# EAGLE design test-cell-one-shot (EAGLE 6.1)
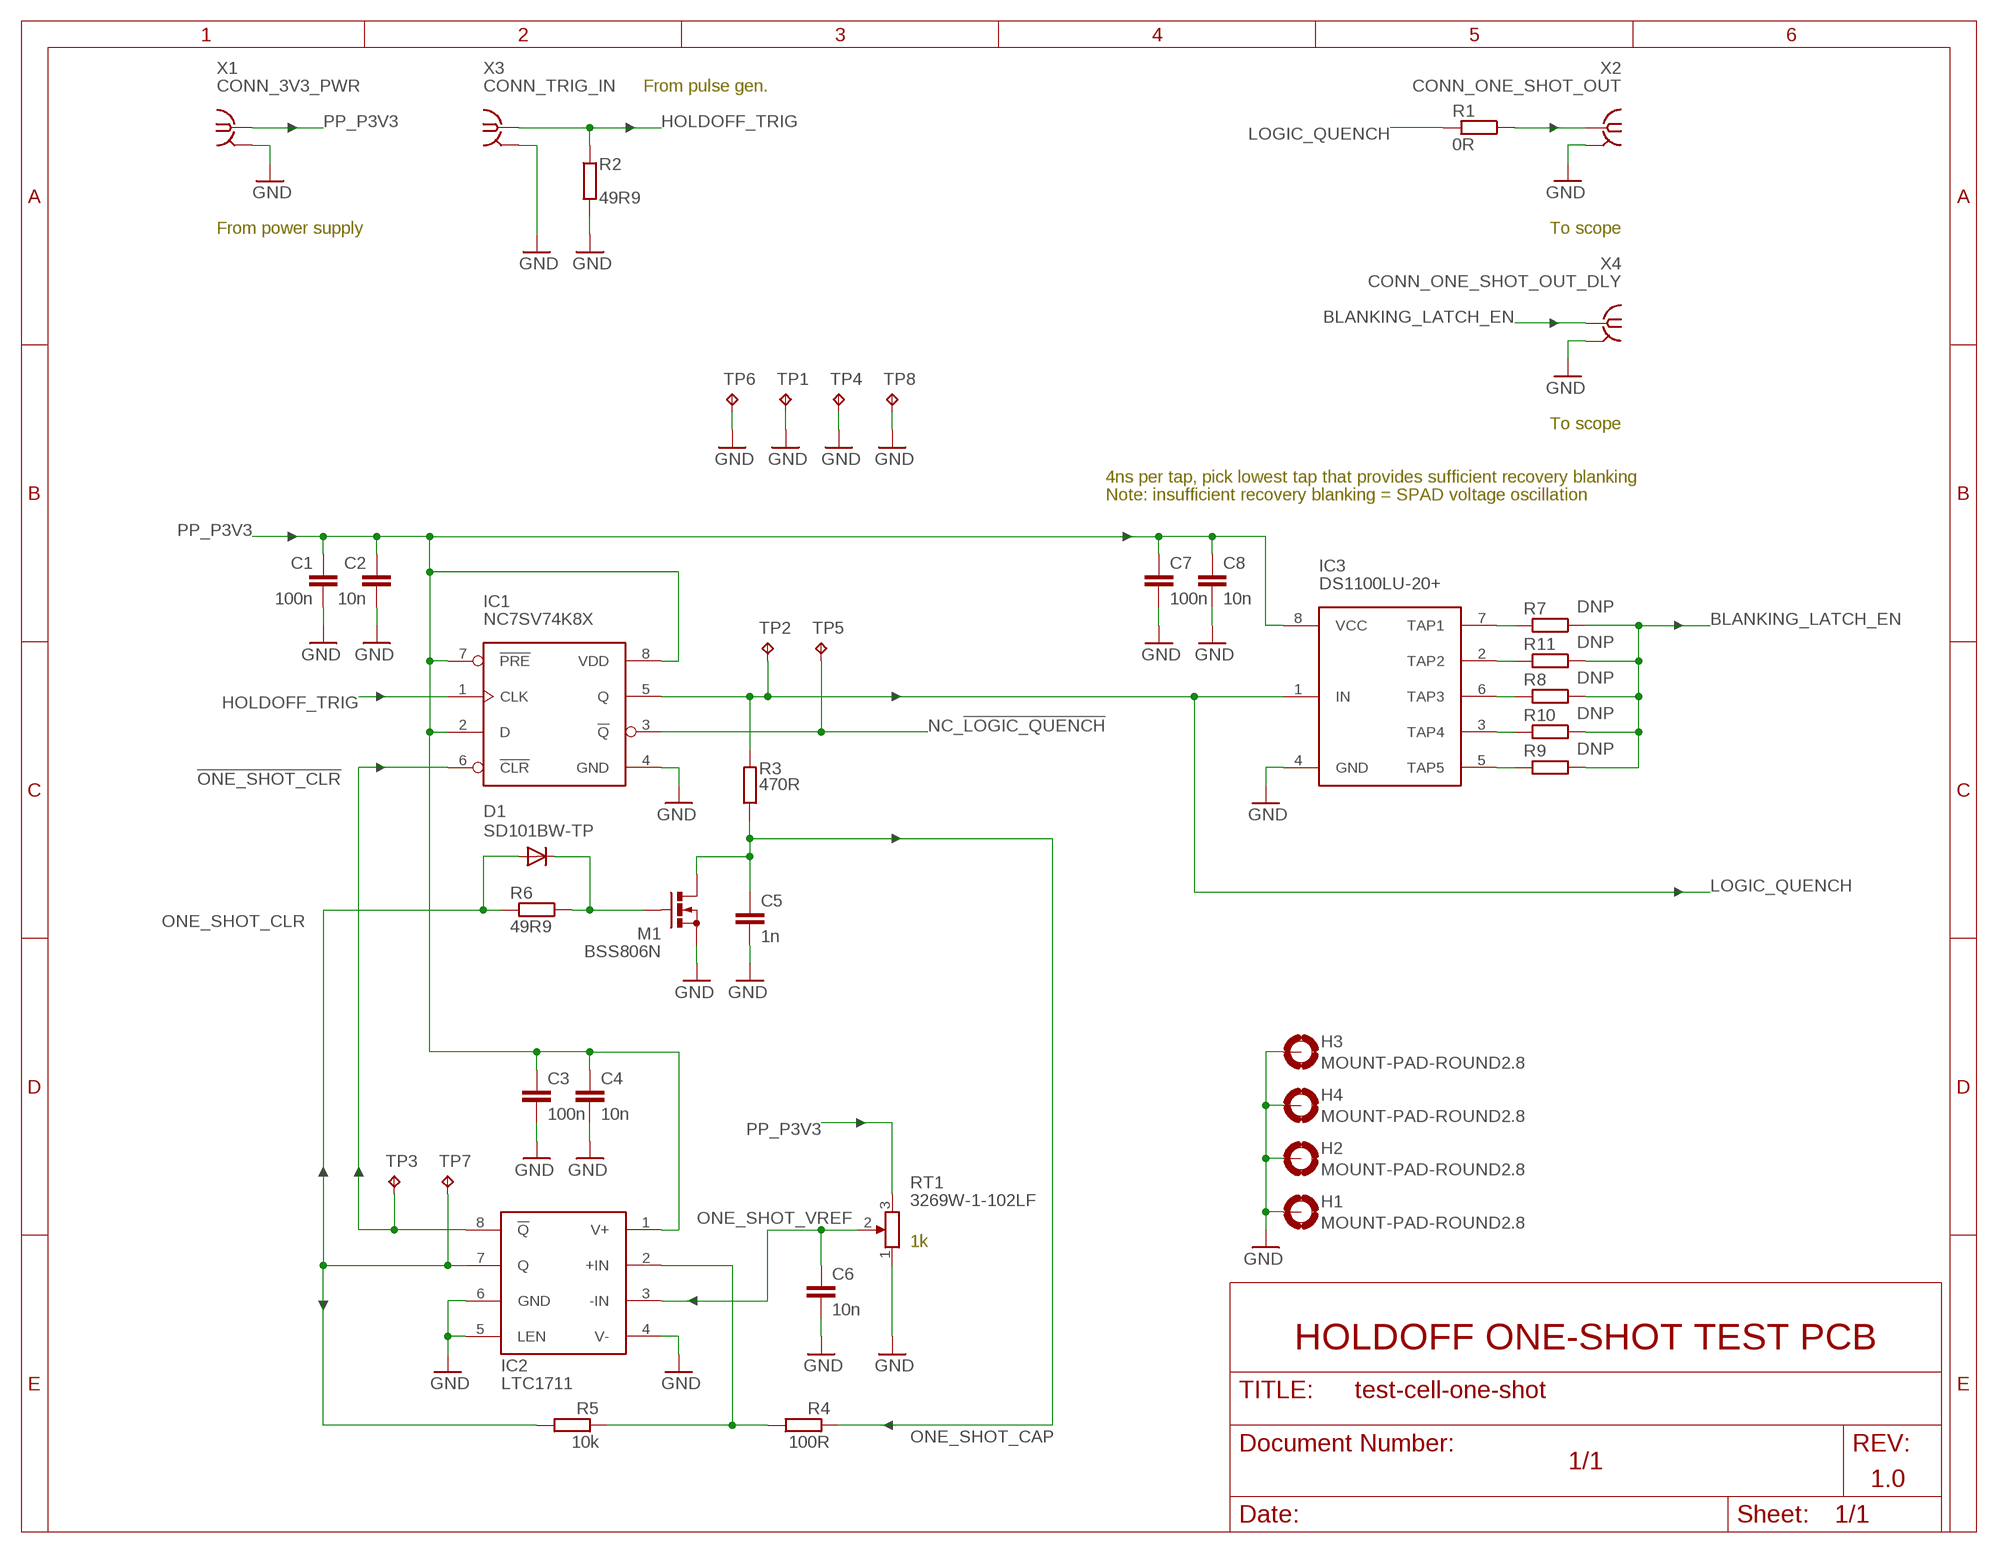
[diagram p0: schematic, sheet 1]

## Parts
C1  100n  C-EUC0402  [C0402]
C2  10n  C-EUC0402  [C0402]
C3  100n  C-EUC0402  [C0402]
C4  10n  C-EUC0402  [C0402]
C5  1n  C-EUC0402  [C0402]
C6  10n  C-EUC0402  [C0402]
C7  100n  C-EUC0402  [C0402]
C8  10n  C-EUC0402  [C0402]
D1  SD101BW-TP  DIODE-SOD123  [SOD123]
H1  MOUNT-PAD-ROUND2.8  [2,8-PAD]
H2  MOUNT-PAD-ROUND2.8  [2,8-PAD]
H3  MOUNT-PAD-ROUND2.8  [2,8-PAD]
H4  MOUNT-PAD-ROUND2.8  [2,8-PAD]
IC1  NC7SV74K8X  [US8_3.1MM_JDEC_MO-187]
IC2  LTC1711  [US8_3.1MM_JDEC_MO-187]
IC3  DS1100LU-20+  DS1100L  [US8_3.1MM_JDEC_MO-187]
M1  BSS806N  [SOT23R_INFINEON]
R1  0R  R-EU_R0402  [R0402]
R2  49R9  R-EU_R0603  [R0603]
R3  470R  R-EU_R0402  [R0402]
R4  100R  R-EU_R0402  [R0402]
R5  10k  R-EU_R0402  [R0402]
R6  49R9  R-EU_R0402  [R0402]
R7  DNP  R-EU_R0402  [R0402]
R8  DNP  R-EU_R0402  [R0402]
R9  DNP  R-EU_R0402  [R0402]
R10  DNP  R-EU_R0402  [R0402]
R11  DNP  R-EU_R0402  [R0402]
RT1  3269W-1-102LF  BOURNS_3269WX  [3269W]
TP1  TPTP10R  [TP10R]
TP2  TPTP10R  [TP10R]
TP3  TPTP10R  [TP10R]
TP4  TPTP10R  [TP10R]
TP5  TPTP10R  [TP10R]
TP6  TPTP10R  [TP10R]
TP7  TPTP10R  [TP10R]
TP8  TPTP10R  [TP10R]
X1  CONN_3V3_PWR  SMA-142-0711-871/876  [J502-ND-142-0711-871/876]
X2  CONN_ONE_SHOT_OUT  SMA-142-0711-871/876  [J502-ND-142-0711-871/876]
X3  CONN_TRIG_IN  SMA-142-0711-871/876  [J502-ND-142-0711-871/876]
X4  CONN_ONE_SHOT_OUT_DLY  SMA-142-0711-871/876  [J502-ND-142-0711-871/876]

## Nets
!ONE_SHOT_CLR: IC1.6(!CLR) IC2.8(!Q) TP3.TP
BLANKING_LATCH_EN: R7.1 R8.1 R9.1 R10.1 R11.1 X4.1
GND: C1.2 C2.2 C3.2 C4.2 C5.2 C6.2 C7.2 C8.2 H1.B2,8(MOUNT) H2.B2,8(MOUNT) H3.B2,8(MOUNT) H4.B2,8(MOUNT) IC1.4(GND) IC2.4(V-) IC2.5(LEN) IC2.6(GND) IC3.4(GND) M1.2(S) R2.2 RT1.1 TP1.TP TP4.TP TP6.TP TP8.TP X1.G@1(GND) X2.G@1(GND) X3.G@1(GND) X4.G@1(GND)
HOLDOFF_TRIG: IC1.1(CLK) R2.1 X3.1
LOGIC_QUENCH: IC1.5(Q) IC3.1(IN) R1.2 R3.2 TP2.TP
N$1: IC3.5(TAP5) R9.2
N$2: D1.C M1.1(G) R6.1
N$3: R1.1 X2.1
N$7: IC3.3(TAP4) R10.2
N$17: IC3.6(TAP3) R8.2
N$25: IC2.2(+IN) R4.1 R5.2
N$28: IC3.2(TAP2) R11.2
N$32: IC3.7(TAP1) R7.2
NC_!LOGIC_QUENCH: IC1.3(!Q) TP5.TP
ONE_SHOT_CAP: C5.1 M1.3(D) R3.1 R4.2
ONE_SHOT_CLR: D1.A IC2.7(Q) R5.1 R6.2 TP7.TP
ONE_SHOT_VREF: C6.1 IC2.3(-IN) RT1.2
PP_P3V3: C1.1 C2.1 C3.1 C4.1 C7.1 C8.1 IC1.2(D) IC1.7(!PRE) IC1.8(VDD) IC2.1(V+) IC3.8(VCC) RT1.3 X1.1

## Notes on the sheet
- From pulse gen.
- From power supply | To scope
- To scope
- 4ns per tap, pick lowest tap that provides sufficient recovery blanking
- Note: insufficient recovery blanking = SPAD voltage oscillation
- 1k
- HOLDOFF ONE-SHOT TEST PCB
- 1/1
- 1.0

## Power pins joined to a net without a drawn wire
GND: X1.G@2(GND) X1.G@3(GND) X1.G@4(GND) X2.G@2(GND) X2.G@3(GND) X2.G@4(GND) X3.G@2(GND) X3.G@3(GND) X3.G@4(GND) X4.G@2(GND) X4.G@3(GND) X4.G@4(GND)

## Library data of the parts
C1-C8 = rcl:C-EU: CAPACITOR, European symbol
D1 = diode:DIODE-: DIODE
H1-H4 = holes:MOUNT-PAD-ROUND: MOUNTING PAD, round
IC1 = meng:NC7SV74K8X
IC2 = meng:LTC1711
IC3 = meng:DS1100L; VALUE: DS1100L
M1 = meng:BSS806N
R1-R11 = rcl:R-EU_: RESISTOR, European symbol
RT1 = meng:BOURNS_3269WX
TP1-TP8 = testpad:TP: Test pad
X1-X4 = con-coax:SMA-: SMA 50 Ohm End Launch Jack Receptacle - Round Contact Johnson Components Source: www.johnsoncomponents.com .. J502-ND.pdf; MF: JOHNSON COMPONENTS; MPN: 142-0711-871; OC_FARNELL: unknown; OC_NEWARK: 01C1639

## Board
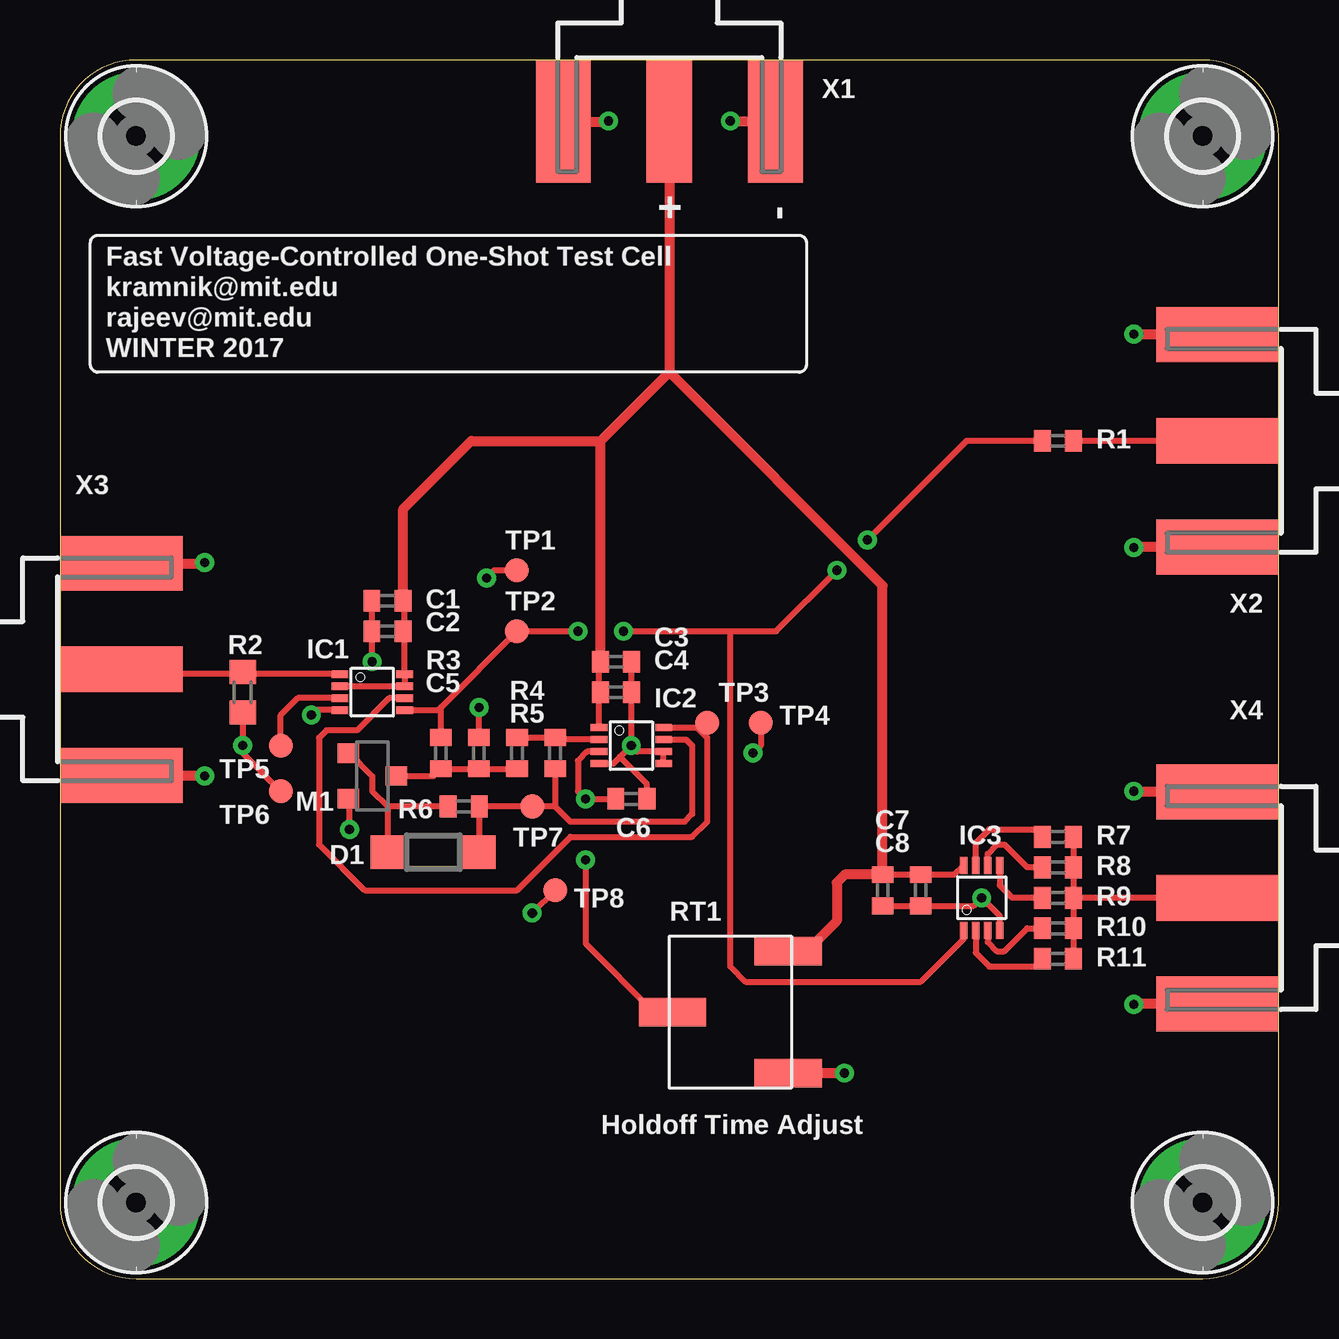
[diagram p1: board, top side]
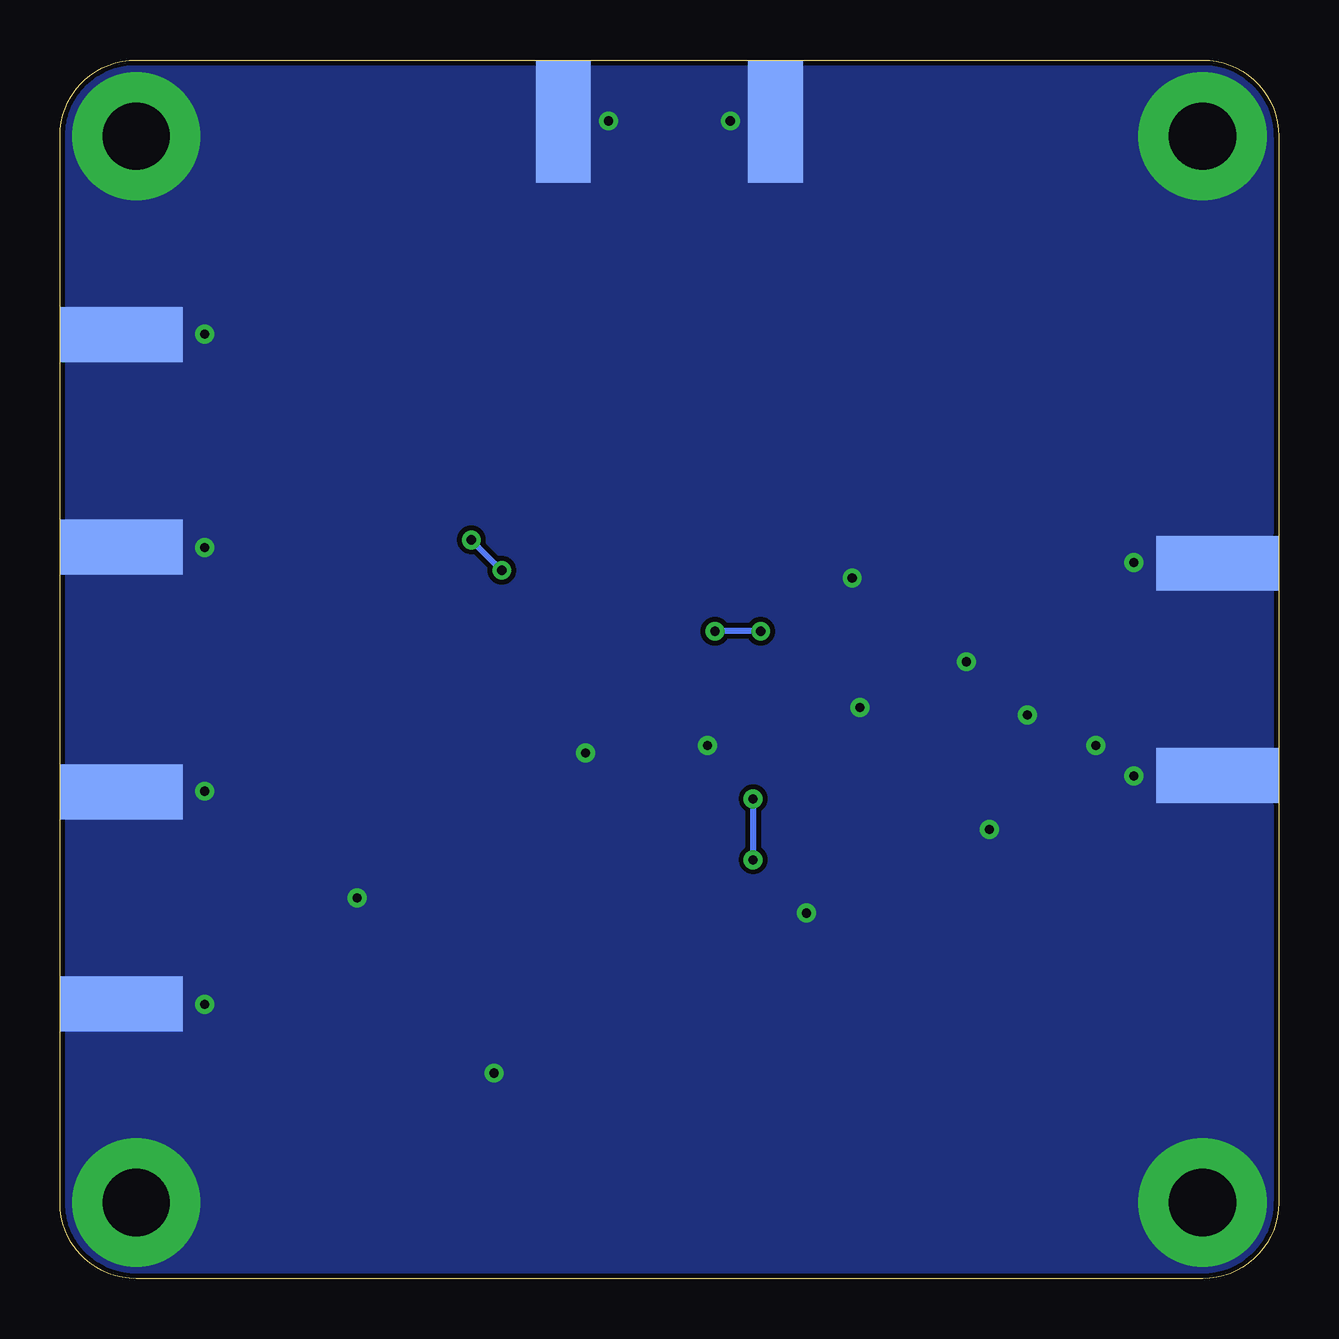
[diagram p2: board, bottom side, seen from below]

Size 50.8 x 50.8 mm. Coordinates in mm from the lower left corner, seen from the top.
Outline: 0,47.62 0,3.17 arc90 3.17,0 47.62,0 arc90 50.8,3.17 50.8,47.62 arc90 47.62,50.8 3.17,50.8 arc90 0,47.62
Copper layers (1*16): Top 0.035mm / dielectric 1.5mm / Bottom 0.035mm
Design rules: minimum track width 10mil, minimum drill 24mil, track to track 8mil, track to pad 8mil, pad to pad 8mil, via to via 8mil, smd to smd 8mil, copper to edge 8mil, drill to drill 8mil, minimum pad ring 10mil, minimum via ring 8mil, stop-mask expansion 4mil, vias tented up to drill 0mil, thermal gap 10mil

### Footprints (pad centres in the part's own frame; a part is rotated, then mirrored left to right if it is on the bottom)
C0402 = smd 0.7 x 0.9: 1 -0.65,0; 2 0.65,0
SOD123 = smd 1.4 x 1.4: A 1.9,0; C -1.9,0
2,8-PAD = drill 2.8 pad 5.334: B2,8 0,0
US8_3.1MM_JDEC_MO-187 = smd 0.3 x 0.7: 1 -0.75,-1.35; 2 -0.25,-1.35; 3 0.25,-1.35; 4 0.75,-1.35; 5 0.75,1.35; 6 0.25,1.35; 7 -0.25,1.35; 8 -0.75,1.35
SOT23R_INFINEON = smd 0.8 x 0.9: 1 -0.95,-1; 2 0.95,-1; 3 0,1
R0402 = smd 0.7 x 0.9: 1 -0.65,0; 2 0.65,0
R0603 = smd 1 x 1.1: 1 -0.85,0; 2 0.85,0
3269W = smd 1.194 x 2.794: 1 -2.54,-2.413; 2 0,2.413; 3 2.54,-2.413
TP10R = smd 1 x 1: TP 0,0
J502-ND-142-0711-871/876 = smd 5.08 x 1.905: 1 2.565,0 | smd 5.08 x 2.286: G@1 2.565,4.42; G@2 2.565,-4.42 | smd 5.08 x 2.286 bottom: G@3 2.565,4.42; G@4 2.565,-4.42

### Placement (x,y rotation side)
C1  13.65,28.26 180 top
C2  13.65,26.99 180 top
C3  23.18,25.72 0 top
C4  23.18,24.45 0 top
C5  17.46,21.91 90 top
C6  23.81,20 0 top
C7  34.29,16.19 270 top
C8  35.88,16.19 270 top
D1  15.56,17.78 0 top
H1  3.17,47.62 0 top
H2  47.62,47.62 0 top
H3  3.17,3.17 0 top
H4  47.62,3.17 0 top
IC1  13.02,24.45 270 top
IC2  23.81,22.23 270 top
IC3  38.42,15.88 0 top
M1  13.02,20.95 270 top
R1  41.59,34.92 180 top
R2  7.62,24.45 270 top
R3  15.88,21.91 90 top
R4  19.05,21.91 270 top
R5  20.64,21.91 90 top
R6  16.83,19.68 0 top
R7  41.59,18.41 180 top
R8  41.59,17.14 180 top
R9  41.59,15.88 180 top
R10  41.59,14.61 180 top
R11  41.59,13.34 180 top
RT1  27.94,11.11 90 top
TP1  19.05,29.53 0 top
TP2  19.05,26.99 0 top
TP3  26.99,23.18 0 top
TP4  29.21,23.18 0 top
TP5  9.21,22.23 0 top
TP6  9.21,20.32 0 top
TP7  19.68,19.68 0 top
TP8  20.64,16.19 0 top
X1  25.4,50.8 270 top
X2  50.8,34.92 180 top
X3  0,25.4 0 top
X4  50.8,15.88 180 top

### Tracks (layer width: path | path; a pad name or v marks a point on that pad's centre or on a via)
!ONE_SHOT_CLR
  Top 0.254: IC1.6 13.72,24.2 12.38,22.86 11.11,22.86 10.79,22.54 10.79,18.1 12.7,16.19 19.05,16.19 21.27,18.41 26.35,18.41 26.99,19.05 26.99,22.54 26.55,22.98 | IC2.8 26.55,22.98 | 26.55,22.98 26.79,22.98 TP3.TP
BLANKING_LATCH_EN
  Top 0.254: R7.1 R8.1 R9.1 | R9.1 R10.1 R11.1 | X4.1 R9.1
GND  (via drill 0.38)
  Top 0.254: R2.2 v7.62,22.23 7.62,21.91 TP6.TP | v13.02,25.72 13.02,26.67 | 13.02,26.67 13.02,27.93 C1.2 | C2.2 13.02,26.67 | v23.81,22.23 24.06,21.98 IC2.6 IC2.5 | IC2.4 23.06,21.48 23.34,21.75 | 23.34,21.75 v23.81,22.23 | v23.81,22.23 23.81,24.77 | 23.81,24.77 23.81,25.7 C3.2 | C4.2 23.81,24.77 | IC3.4 39.17,15.12 v38.42,15.88 38.09,15.54 C8.2 C7.2 | C5.2 v17.46,23.81 | C6.2 24.46,20.62 23.34,21.75 | v12.06,18.73 12.06,19.96 M1.2 | IC1.4 10.68,23.7 v10.48,23.5 | TP1.TP 18.1,29.53 v17.78,29.21 | TP4.TP 29.21,22.23 v28.89,21.91 | TP8.TP v19.68,15.24
  Top 0.406: RT1.1 v32.7,8.57 | X3.G@4 6.01,20.98 v6.03,20.95 | X3.G@1 6.01,29.82 v6.03,29.84 | X4.G@1 44.79,11.46 v44.77,11.43 | X4.G@4 44.79,20.3 v44.77,20.32 | X2.G@1 44.79,30.5 v44.77,30.48 | X2.G@4 44.79,39.34 v44.77,39.37 | X1.G@4 22.84,48.23 v22.86,48.26 | X1.G@1 27.96,48.23 v27.94,48.26
  pour Bottom (no thermals): 0,0 50.8,0 50.8,50.8 0,50.8
HOLDOFF_TRIG
  Top 0.254: IC1.1 7.62,25.2 | 7.62,25.2 2.77,25.2 X3.1 | R2.1 7.62,25.2
LOGIC_QUENCH  (via drill 0.38)
  Top 0.254: 27.94,26.99 27.94,13.02 28.57,12.38 35.88,12.38 37.67,14.17 IC3.1 | R3.2 15.88,23.81 | 15.88,23.81 TP2.TP v21.59,26.99 | v23.5,26.99 27.94,26.99 | 27.94,26.99 29.84,26.99 v32.38,29.53 | IC1.5 15.76,23.7 15.88,23.81 | R1.2 37.78,34.92 v33.66,30.8
  Bottom 0.254: v21.59,26.99 v23.5,26.99 | v32.38,29.53 v33.66,30.8
N$1
  Top 0.254: R9.2 39.69,15.88 39.17,16.39 IC3.5
N$2
  Top 0.254: M1.1 12.07,21.91 13.02,20.95 13.02,20.32 13.65,19.68 | R6.1 13.65,19.68 | 13.65,19.68 D1.C
N$3
  Top 0.254: X2.1 R1.1
N$7
  Top 0.254: IC3.3 38.67,14.04 39.05,13.65 39.37,13.65 40.32,14.61 R10.2
N$17
  Top 0.254: IC3.6 38.67,17.71 39.05,18.1 39.37,18.1 40.32,17.14 R8.2
N$25
  Top 0.254: IC2.2 20.72,22.48 R5.2 R4.1
N$28
  Top 0.254: R11.2 40.96,13.34 40.64,13.02 38.73,13.02 38.17,13.59 IC3.2
N$32
  Top 0.254: R7.2 40.96,18.41 40.64,18.73 38.73,18.73 38.17,18.16 IC3.7
NC_!LOGIC_QUENCH
  Top 0.254: IC1.3 9.91,24.2 9.21,23.5 TP5.TP
ONE_SHOT_CAP
  Top 0.254: M1.3 15.57,20.95 R3.1 C5.1 R4.2
ONE_SHOT_CLR
  Top 0.254: D1.A 17.48,17.8 R6.2 TP7.TP 20.64,19.68 | IC2.7 26.1,22.48 26.35,22.23 26.35,19.37 26.04,19.05 21.27,19.05 20.64,19.68 | R5.1 20.64,19.68
ONE_SHOT_VREF  (via drill 0.38)
  Top 0.254: IC2.3 21.98,21.98 21.59,21.59 21.59,20.32 v21.91,20 C6.1 | v21.91,17.46 21.91,13.97 24.77,11.11 RT1.2
  Bottom 0.254: v21.91,20 v21.91,17.46
PP_P3V3
  Top 0.254: IC1.2 IC1.7 IC1.8 14.37,26.67 | 14.37,26.67 14.37,27.88 C1.1 | C2.1 14.37,26.67 | IC2.1 22.46,24.77 | 22.46,24.77 22.46,25.65 C3.1 | C4.1 22.46,24.77 | C7.1 C8.1 37.28,16.84 IC3.8
  Top 0.406: X1.1 25.4,37.78 | C3.1 22.53,34.91 | 22.53,34.91 25.4,37.78 | C1.1 14.3,32.08 17.14,34.92 22.51,34.92 22.53,34.91 | 30.37,13.67 RT1.3 31.11,13.65 32.38,14.92 32.38,16.51 32.72,16.84 C7.1 34.29,28.89 25.4,37.78

### Text on the board
tPlace: + | - | Fast Voltage-Controlled One-Shot Test Cell | kramnik@mit.edu | rajeev@mit.edu | WINTER 2017 | Holdoff Time Adjust